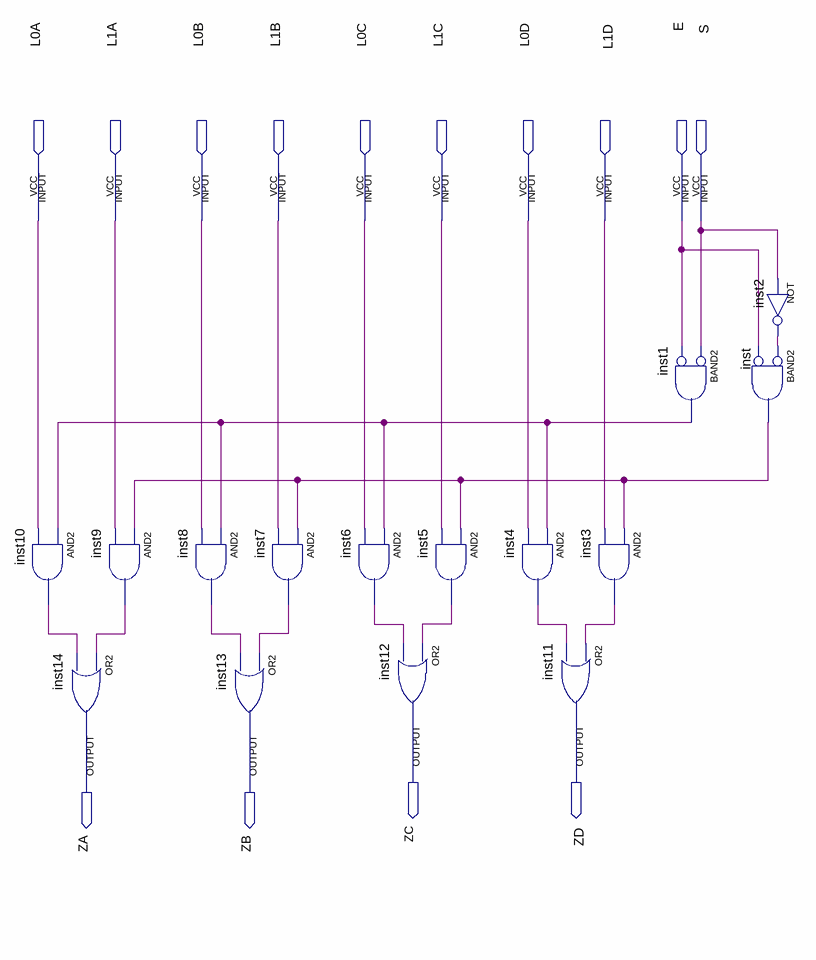
[diagram p0: schematic sheet]
// Quartus schematic CI_74LS157.bdf as structural Verilog: 15 symbols, 14 pins
module CI_74LS157 (
  input  L0A,
  input  L1A,
  input  L0B,
  input  L1B,
  input  L0C,
  input  L1C,
  input  L0D,
  input  L1D,
  input  E,
  input  S,
  output ZC,
  output ZD,
  output ZA,
  output ZB
);

  wire inst1_out, inst2_out, inst3_out, inst4_out, inst5_out, inst6_out, inst7_out, inst8_out, inst9_out,
       inst10_out, inst_out;

  and inst10 (inst10_out, inst1_out, L0A);
  and inst9 (inst9_out, inst_out, L1A);
  or inst14 (ZA, inst9_out, inst10_out);
  and inst8 (inst8_out, inst1_out, L0B);
  and inst7 (inst7_out, inst_out, L1B);
  or inst13 (ZB, inst7_out, inst8_out);
  and inst6 (inst6_out, inst1_out, L0C);
  and inst5 (inst5_out, inst_out, L1C);
  or inst12 (ZC, inst5_out, inst6_out);
  and inst4 (inst4_out, inst1_out, L0D);
  or inst11 (ZD, inst3_out, inst4_out);
  and inst3 (inst3_out, inst_out, L1D);
  and inst1 (inst1_out, ~S, ~E);  // BAND2
  not inst2 (inst2_out, S);
  and inst (inst_out, ~inst2_out, ~E);  // BAND2
endmodule
